# Altium schematic sheet Mux_Demux.SchDoc
size OrCAD E; SheetNumber: 3; SheetTotal: 6
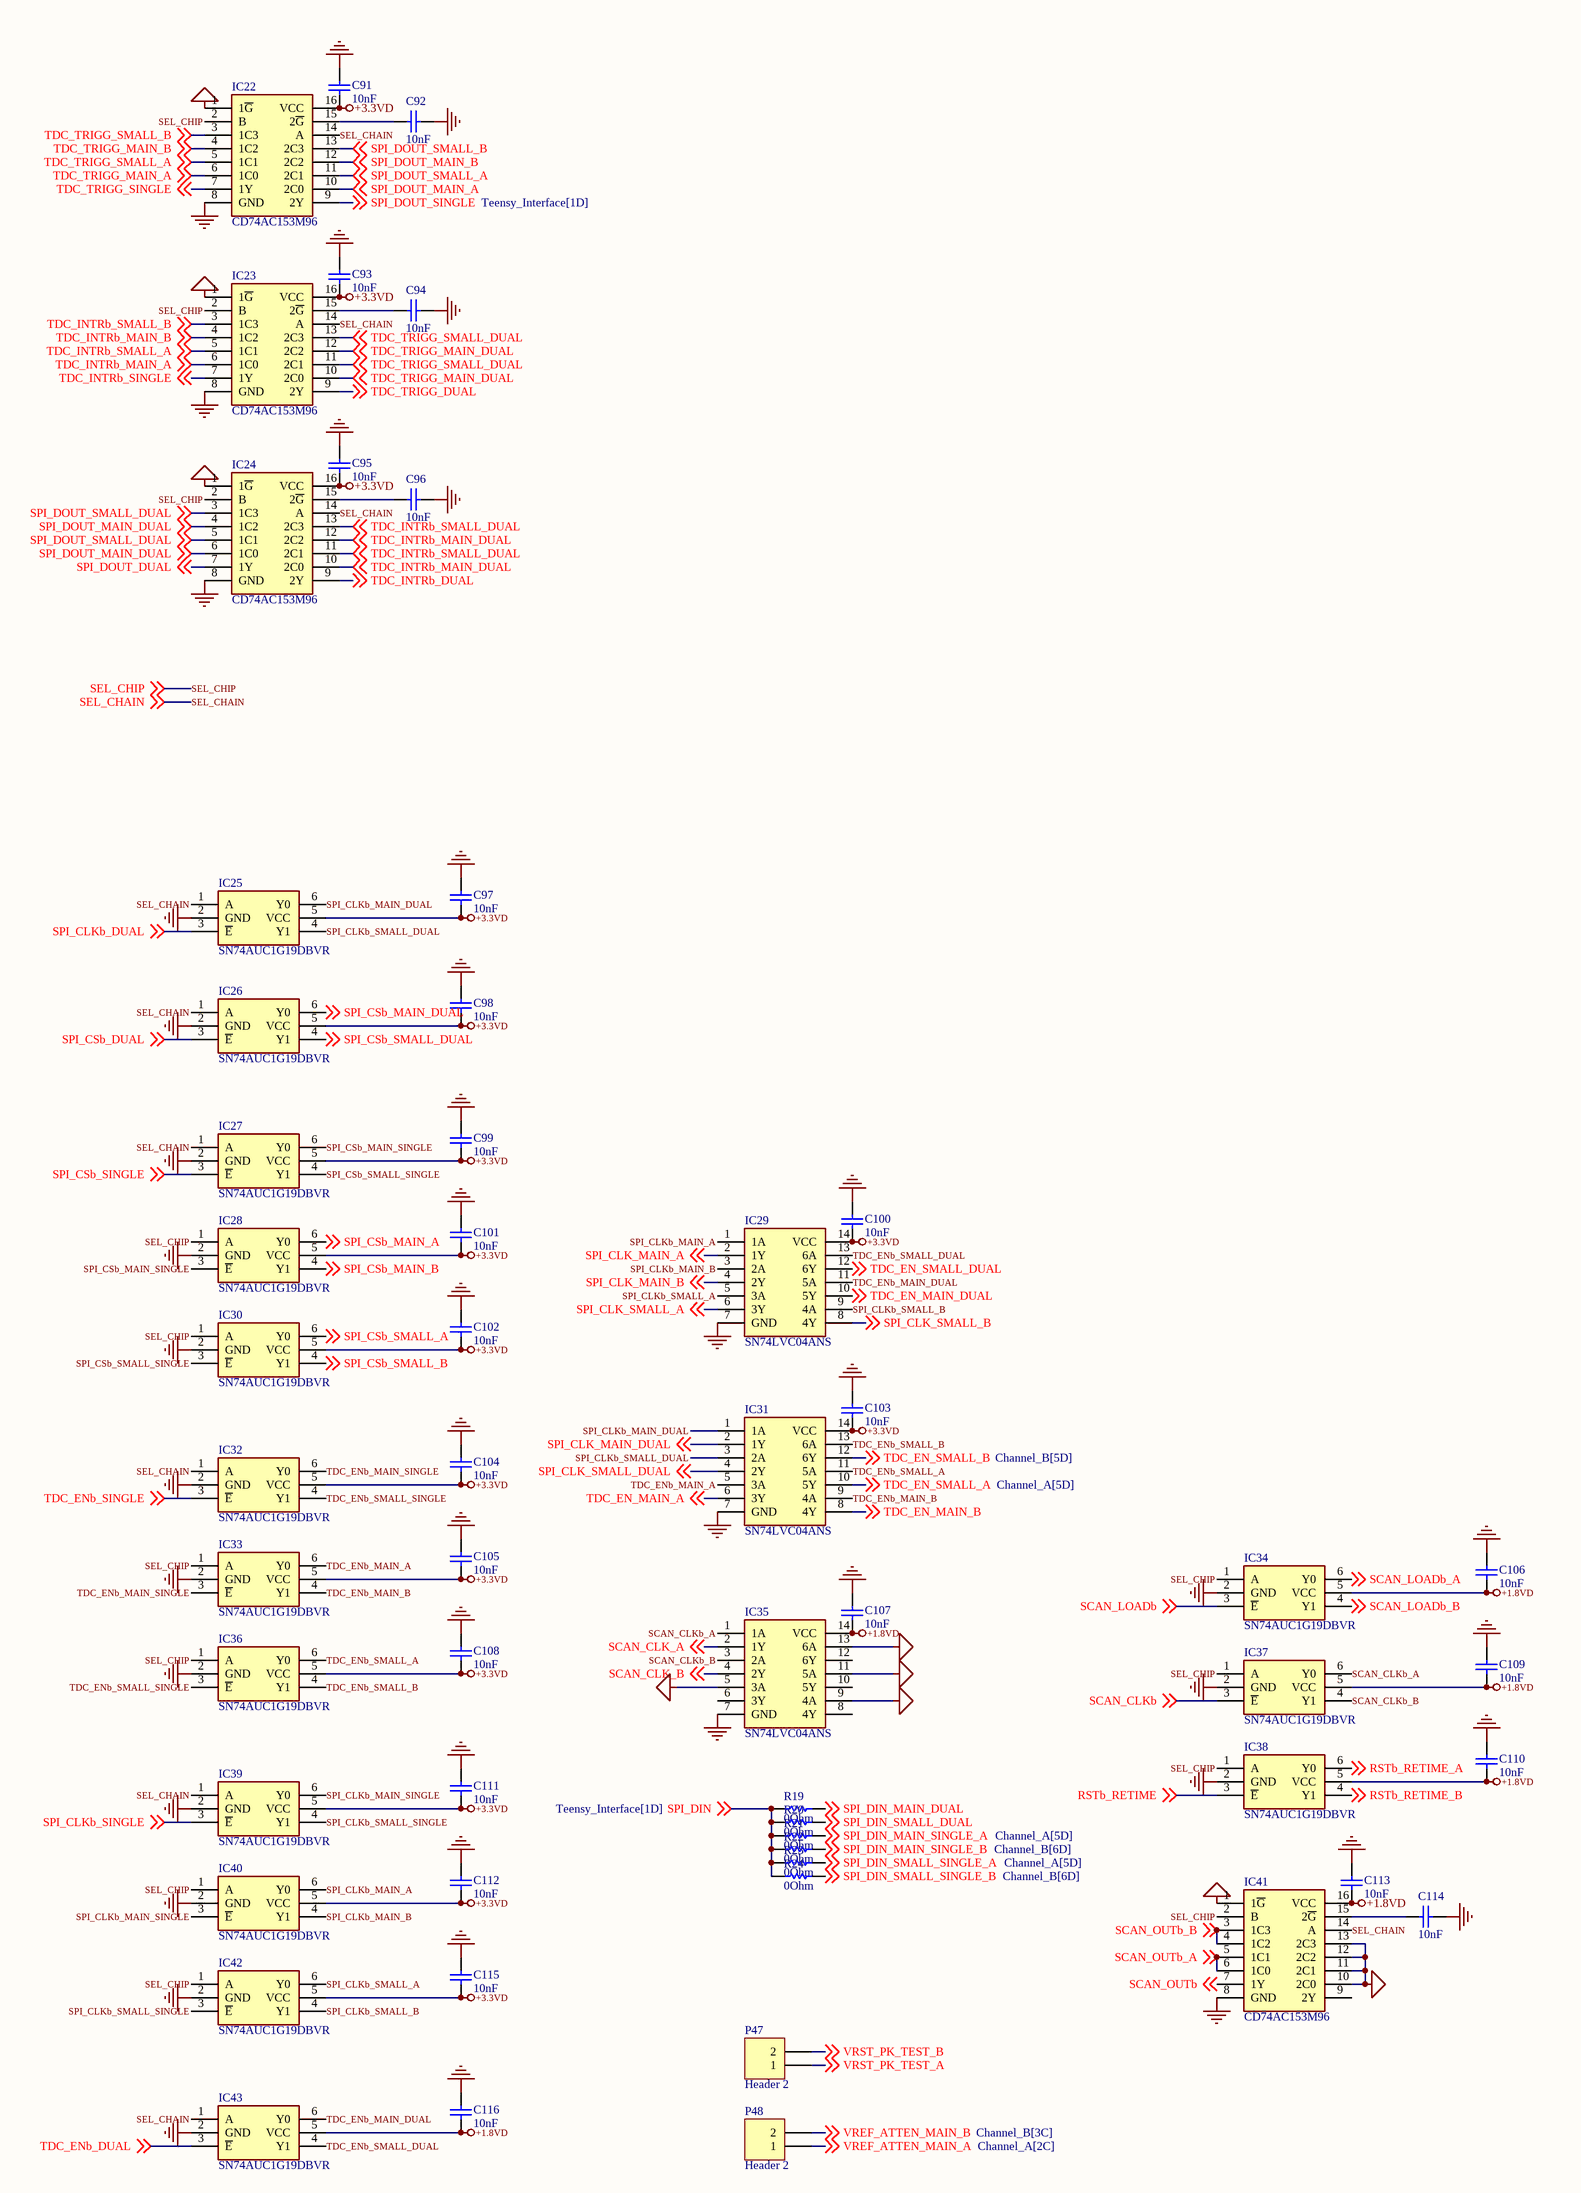
[diagram p0: Mux_Demux.SchDoc]

## Parts
C91  10nF  [CAPC1608X90X35ML10T15]
C92  10nF  [CAPC1608X90X35ML10T15]
C93  10nF  [CAPC1608X90X35ML10T15]
C94  10nF  [CAPC1608X90X35ML10T15]
C95  10nF  [CAPC1608X90X35ML10T15]
C96  10nF  [CAPC1608X90X35ML10T15]
C97  10nF  [CAPC1608X90X35ML10T15]
C98  10nF  [CAPC1608X90X35ML10T15]
C99  10nF  [CAPC1608X90X35ML10T15]
C100  10nF  [CAPC1608X90X35ML10T15]
C101  10nF  [CAPC1608X90X35ML10T15]
C102  10nF  [CAPC1608X90X35ML10T15]
C103  10nF  [CAPC1608X90X35ML10T15]
C104  10nF  [CAPC1608X90X35ML10T15]
C105  10nF  [CAPC1608X90X35ML10T15]
C106  10nF  [CAPC1608X90X35ML10T15]
C107  10nF  [CAPC1608X90X35ML10T15]
C108  10nF  [CAPC1608X90X35ML10T15]
C109  10nF  [CAPC1608X90X35ML10T15]
C110  10nF  [CAPC1608X90X35ML10T15]
C111  10nF  [CAPC1608X90X35ML10T15]
C112  10nF  [CAPC1608X90X35ML10T15]
C113  10nF  [CAPC1608X90X35ML10T15]
C114  10nF  [CAPC1608X90X35ML10T15]
C115  10nF  [CAPC1608X90X35ML10T15]
C116  10nF  [CAPC1608X90X35ML10T15]
IC22  CD74AC153M96  [SOIC127P600X175-16N]
IC23  CD74AC153M96  [SOIC127P600X175-16N]
IC24  CD74AC153M96  [SOIC127P600X175-16N]
IC25  SN74AUC1G19DBVR  [SOT95P280X145-6N]
IC26  SN74AUC1G19DBVR  [SOT95P280X145-6N]
IC27  SN74AUC1G19DBVR  [SOT95P280X145-6N]
IC28  SN74AUC1G19DBVR  [SOT95P280X145-6N]
IC29  SN74LVC04ANS  [SOIC127P780X200-14N]
IC30  SN74AUC1G19DBVR  [SOT95P280X145-6N]
IC31  SN74LVC04ANS  [SOIC127P780X200-14N]
IC32  SN74AUC1G19DBVR  [SOT95P280X145-6N]
IC33  SN74AUC1G19DBVR  [SOT95P280X145-6N]
IC34  SN74AUC1G19DBVR  [SOT95P280X145-6N]
IC35  SN74LVC04ANS  [SOIC127P780X200-14N]
IC36  SN74AUC1G19DBVR  [SOT95P280X145-6N]
IC37  SN74AUC1G19DBVR  [SOT95P280X145-6N]
IC38  SN74AUC1G19DBVR  [SOT95P280X145-6N]
IC39  SN74AUC1G19DBVR  [SOT95P280X145-6N]
IC40  SN74AUC1G19DBVR  [SOT95P280X145-6N]
IC41  CD74AC153M96  [SOIC127P600X175-16N]
IC42  SN74AUC1G19DBVR  [SOT95P280X145-6N]
IC43  SN74AUC1G19DBVR  [SOT95P280X145-6N]
P47  Header 2  [HDR1X2]
P48  Header 2  [HDR1X2]
R19  0Ohm  [RESC1609X50X30NL8T20]
R20  0Ohm  [RESC1609X50X30NL8T20]
R21  0Ohm  [RESC1609X50X30NL8T20]
R22  0Ohm  [RESC1609X50X30NL8T20]
R23  0Ohm  [RESC1609X50X30NL8T20]
R24  0Ohm  [RESC1609X50X30NL8T20]

## Nets
+1.8VD: C106.1 C107.1 C109.1 C110.1 C113.1 C116.1 IC34.5(VCC) IC35.14(VCC) IC37.5(VCC) IC38.5(VCC) IC41.16(VCC) IC43.5(VCC)
+3.3VD: C91.1 C93.1 C95.1 C97.1 C98.1 C99.1 C100.1 C101.1 C102.1 C103.1 C104.1 C105.1 C108.1 C111.1 C112.1 C115.1 IC22.16(VCC) IC23.16(VCC) IC24.16(VCC) IC25.5(VCC) IC26.5(VCC) IC27.5(VCC) IC28.5(VCC) IC29.14(VCC) IC30.5(VCC) IC31.14(VCC) IC32.5(VCC) IC33.5(VCC) IC36.5(VCC) IC39.5(VCC) IC40.5(VCC) IC42.5(VCC)
GND: C91.2 C92.2 C93.2 C94.2 C95.2 C96.2 C97.2 C98.2 C99.2 C100.2 C101.2 C102.2 C103.2 C104.2 C105.2 C106.2 C107.2 C108.2 C109.2 C110.2 C111.2 C112.2 C113.2 C114.2 C115.2 C116.2 IC22.1(1~{G}) IC22.8(GND) IC23.1(1~{G}) IC23.8(GND) IC24.1(1~{G}) IC24.8(GND) IC25.2(GND) IC26.2(GND) IC27.2(GND) IC28.2(GND) IC29.7(GND) IC30.2(GND) IC31.7(GND) IC32.2(GND) IC33.2(GND) IC34.2(GND) IC35.5(3A) IC35.7(GND) IC35.9(4A) IC35.11(5A) IC35.13(6A) IC36.2(GND) IC37.2(GND) IC38.2(GND) IC39.2(GND) IC40.2(GND) IC41.1(1~{G}) IC41.8(GND) IC41.10(2C0) IC41.11(2C1) IC41.12(2C2) IC41.13(2C3) IC42.2(GND) IC43.2(GND)
RSTb_RETIME: IC38.3(~{E}) ; off-sheet RSTb_RETIME
RSTb_RETIME_A: IC38.6(Y0) ; off-sheet RSTb_RETIME_A
RSTb_RETIME_B: IC38.4(Y1) ; off-sheet RSTb_RETIME_B
SCAN_CLK_A: IC35.2(1Y) ; off-sheet SCAN_CLK_A
SCAN_CLK_B: IC35.4(2Y) ; off-sheet SCAN_CLK_B
SCAN_CLKb: IC37.3(~{E}) ; off-sheet SCAN_CLKb
SCAN_CLKb_A: IC35.1(1A) IC37.6(Y0)
SCAN_CLKb_B: IC35.3(2A) IC37.4(Y1)
SCAN_LOADb: IC34.3(~{E}) ; off-sheet SCAN_LOADb
SCAN_LOADb_A: IC34.6(Y0) ; off-sheet SCAN_LOADb_A
SCAN_LOADb_B: IC34.4(Y1) ; off-sheet SCAN_LOADb_B
SCAN_OUTb: IC41.7(1Y) ; off-sheet SCAN_OUTb
SCAN_OUTb_A: IC41.5(1C1) IC41.6(1C0) ; off-sheet SCAN_OUTb_A
SCAN_OUTb_B: IC41.3(1C3) IC41.4(1C2) ; off-sheet SCAN_OUTb_B
SEL_CHAIN: IC22.14(A) IC23.14(A) IC24.14(A) IC25.1(A) IC26.1(A) IC27.1(A) IC32.1(A) IC39.1(A) IC41.14(A) IC43.1(A) ; off-sheet SEL_CHAIN
SEL_CHIP: IC22.2(B) IC23.2(B) IC24.2(B) IC28.1(A) IC30.1(A) IC33.1(A) IC34.1(A) IC36.1(A) IC37.1(A) IC38.1(A) IC40.1(A) IC41.2(B) IC42.1(A) ; off-sheet SEL_CHIP
SPI_CLK_MAIN_A: IC29.2(1Y) ; off-sheet SPI_CLK_MAIN_A
SPI_CLK_MAIN_B: IC29.4(2Y) ; off-sheet SPI_CLK_MAIN_B
SPI_CLK_MAIN_DUAL: IC31.2(1Y) ; off-sheet SPI_CLK_MAIN_DUAL
SPI_CLK_SMALL_A: IC29.6(3Y) ; off-sheet SPI_CLK_SMALL_A
SPI_CLK_SMALL_B: IC29.8(4Y) ; off-sheet SPI_CLK_SMALL_B
SPI_CLK_SMALL_DUAL: IC31.4(2Y) ; off-sheet SPI_CLK_SMALL_DUAL
SPI_CLKb_DUAL: IC25.3(~{E}) ; off-sheet SPI_CLKb_DUAL
SPI_CLKb_MAIN_A: IC29.1(1A) IC40.6(Y0)
SPI_CLKb_MAIN_B: IC29.3(2A) IC40.4(Y1)
SPI_CLKb_MAIN_DUAL: IC25.6(Y0) IC31.1(1A)
SPI_CLKb_MAIN_SINGLE: IC39.6(Y0) IC40.3(~{E})
SPI_CLKb_SINGLE: IC39.3(~{E}) ; off-sheet SPI_CLKb_SINGLE
SPI_CLKb_SMALL_A: IC29.5(3A) IC42.6(Y0)
SPI_CLKb_SMALL_B: IC29.9(4A) IC42.4(Y1)
SPI_CLKb_SMALL_DUAL: IC25.4(Y1) IC31.3(2A)
SPI_CLKb_SMALL_SINGLE: IC39.4(Y1) IC42.3(~{E})
SPI_CSb_DUAL: IC26.3(~{E}) ; off-sheet SPI_CSb_DUAL
SPI_CSb_MAIN_A: IC28.6(Y0) ; off-sheet SPI_CSb_MAIN_A
SPI_CSb_MAIN_B: IC28.4(Y1) ; off-sheet SPI_CSb_MAIN_B
SPI_CSb_MAIN_DUAL: IC26.6(Y0) ; off-sheet SPI_CSb_MAIN_DUAL
SPI_CSb_MAIN_SINGLE: IC27.6(Y0) IC28.3(~{E})
SPI_CSb_SINGLE: IC27.3(~{E}) ; off-sheet SPI_CSb_SINGLE
SPI_CSb_SMALL_A: IC30.6(Y0) ; off-sheet SPI_CSb_SMALL_A
SPI_CSb_SMALL_B: IC30.4(Y1) ; off-sheet SPI_CSb_SMALL_B
SPI_CSb_SMALL_DUAL: IC26.4(Y1) ; off-sheet SPI_CSb_SMALL_DUAL
SPI_CSb_SMALL_SINGLE: IC27.4(Y1) IC30.3(~{E})
SPI_DIN: R19.2 R20.2 R21.2 R22.2 R23.2 R24.2 ; off-sheet SPI_DIN
SPI_DIN_MAIN_DUAL: R19.1 ; off-sheet SPI_DIN_MAIN_DUAL
SPI_DIN_MAIN_SINGLE_A: R21.1 ; off-sheet SPI_DIN_MAIN_SINGLE_A
SPI_DIN_MAIN_SINGLE_B: R22.1 ; off-sheet SPI_DIN_MAIN_SINGLE_B
SPI_DIN_SMALL_DUAL: R20.1 ; off-sheet SPI_DIN_SMALL_DUAL
SPI_DIN_SMALL_SINGLE_A: R23.1 ; off-sheet SPI_DIN_SMALL_SINGLE_A
SPI_DIN_SMALL_SINGLE_B: R24.1 ; off-sheet SPI_DIN_SMALL_SINGLE_B
SPI_DOUT_DUAL: IC24.7(1Y) ; off-sheet SPI_DOUT_DUAL
SPI_DOUT_MAIN_A: IC22.10(2C0) ; off-sheet SPI_DOUT_MAIN_A
SPI_DOUT_MAIN_B: IC22.12(2C2) ; off-sheet SPI_DOUT_MAIN_B
SPI_DOUT_MAIN_DUAL: IC24.4(1C2) IC24.6(1C0) ; off-sheet SPI_DOUT_MAIN_DUAL
SPI_DOUT_SINGLE: IC22.9(2Y) ; off-sheet SPI_DOUT_SINGLE
SPI_DOUT_SMALL_A: IC22.11(2C1) ; off-sheet SPI_DOUT_SMALL_A
SPI_DOUT_SMALL_B: IC22.13(2C3) ; off-sheet SPI_DOUT_SMALL_B
SPI_DOUT_SMALL_DUAL: IC24.3(1C3) IC24.5(1C1) ; off-sheet SPI_DOUT_SMALL_DUAL
TDC_EN_MAIN_A: IC31.6(3Y) ; off-sheet TDC_EN_MAIN_A
TDC_EN_MAIN_B: IC31.8(4Y) ; off-sheet TDC_EN_MAIN_B
TDC_EN_MAIN_DUAL: IC29.10(5Y) ; off-sheet TDC_EN_MAIN_DUAL
TDC_EN_SMALL_A: IC31.10(5Y) ; off-sheet TDC_EN_SMALL_A
TDC_EN_SMALL_B: IC31.12(6Y) ; off-sheet TDC_EN_SMALL_B
TDC_EN_SMALL_DUAL: IC29.12(6Y) ; off-sheet TDC_EN_SMALL_DUAL
TDC_ENb_DUAL: IC43.3(~{E}) ; off-sheet TDC_ENb_DUAL
TDC_ENb_MAIN_A: IC31.5(3A) IC33.6(Y0)
TDC_ENb_MAIN_B: IC31.9(4A) IC33.4(Y1)
TDC_ENb_MAIN_DUAL: IC29.11(5A) IC43.6(Y0)
TDC_ENb_MAIN_SINGLE: IC32.6(Y0) IC33.3(~{E})
TDC_ENb_SINGLE: IC32.3(~{E}) ; off-sheet TDC_ENb_SINGLE
TDC_ENb_SMALL_A: IC31.11(5A) IC36.6(Y0)
TDC_ENb_SMALL_B: IC31.13(6A) IC36.4(Y1)
TDC_ENb_SMALL_DUAL: IC29.13(6A) IC43.4(Y1)
TDC_ENb_SMALL_SINGLE: IC32.4(Y1) IC36.3(~{E})
TDC_INTRb_DUAL: IC24.9(2Y) ; off-sheet TDC_INTRb_DUAL
TDC_INTRb_MAIN_A: IC23.6(1C0) ; off-sheet TDC_INTRb_MAIN_A
TDC_INTRb_MAIN_B: IC23.4(1C2) ; off-sheet TDC_INTRb_MAIN_B
TDC_INTRb_MAIN_DUAL: IC24.10(2C0) IC24.12(2C2) ; off-sheet TDC_INTRb_MAIN_DUAL
TDC_INTRb_SINGLE: IC23.7(1Y) ; off-sheet TDC_INTRb_SINGLE
TDC_INTRb_SMALL_A: IC23.5(1C1) ; off-sheet TDC_INTRb_SMALL_A
TDC_INTRb_SMALL_B: IC23.3(1C3) ; off-sheet TDC_INTRb_SMALL_B
TDC_INTRb_SMALL_DUAL: IC24.11(2C1) IC24.13(2C3) ; off-sheet TDC_INTRb_SMALL_DUAL
TDC_TRIGG_DUAL: IC23.9(2Y) ; off-sheet TDC_TRIGG_DUAL
TDC_TRIGG_MAIN_A: IC22.6(1C0) ; off-sheet TDC_TRIGG_MAIN_A
TDC_TRIGG_MAIN_B: IC22.4(1C2) ; off-sheet TDC_TRIGG_MAIN_B
TDC_TRIGG_MAIN_DUAL: IC23.10(2C0) IC23.12(2C2) ; off-sheet TDC_TRIGG_MAIN_DUAL
TDC_TRIGG_SINGLE: IC22.7(1Y) ; off-sheet TDC_TRIGG_SINGLE
TDC_TRIGG_SMALL_A: IC22.5(1C1) ; off-sheet TDC_TRIGG_SMALL_A
TDC_TRIGG_SMALL_B: IC22.3(1C3) ; off-sheet TDC_TRIGG_SMALL_B
TDC_TRIGG_SMALL_DUAL: IC23.11(2C1) IC23.13(2C3) ; off-sheet TDC_TRIGG_SMALL_DUAL
VREF_ATTEN_MAIN_A: P48.1 ; off-sheet VREF_ATTEN_MAIN_A
VREF_ATTEN_MAIN_B: P48.2 ; off-sheet VREF_ATTEN_MAIN_B
VRST_PK_TEST_A: P47.1 ; off-sheet VRST_PK_TEST_A
VRST_PK_TEST_B: P47.2 ; off-sheet VRST_PK_TEST_B
NetC92_1: C92.1 IC22.15(2~{G})
NetC94_1: C94.1 IC23.15(2~{G})
NetC96_1: C96.1 IC24.15(2~{G})
NetC114_1: C114.1 IC41.15(2~{G})

Not connected (* = marked no-connect by the designer): IC35 6(3Y) 8(4Y) 10(5Y) 12(6Y); IC41 9(2Y)

## Library data of the parts
C91-C116 = CMP-2000-04945-1: 0603; Manufacturer: Murata; Capacitance: 22pF; Tolerance (%): ±5%; Rated Voltage: 50V; Dielectric: C0G; Manufacturer URL: http://www.murata.com/; Datasheet Version: Jul-06; Package Reference: 603; Case Size/Dimension: 0603; Package Description: 2-Pin Surface Mount Device, Body 1.6 x 0.8 mm; Datasheet URL: https://datasheet.ciiva.com/11786/0900766b807a1cab-11786398.pdf
IC22-IC24 IC41 = CD74AC153M96: Encoders, Decoders, Multiplexers & Demultiplexers Dual 4-Input; Manufacturer_Name: Texas Instruments; Datasheet Link: https://www.ti.com/lit/ds/symlink/cd74ac153.pdf?ts=1617785711495&ref_url=https%253A%252F%252Fwww.ti.com%252Fstore%252Fti%252Fen%252Fp%252Fproduct%252F%253Fp%253DCD74AC153M96; Height: 1.75mm; Manufacturer_Part_Number: CD74AC153M96; Mouser Part Number: 595-CD74AC153M96; Mouser Price/Stock: https://www.mouser.co.uk/ProductDetail/Texas-Instruments/CD74AC153M96?qs=bkMXpVdiF41Yiv9m4vuwDg%3D%3D; Arrow Part Number: CD74AC153M96; Arrow Price/Stock: https://www.arrow.com/en/products/cd74ac153m96/texas-instruments
IC25-IC28 IC30 IC32-IC34 IC36-IC40 IC42 IC43 = SN74AUC1G19DBVR: Encoders, Decoders, Multiplexers & Demultiplexers 1 of 2 Decoder DeMultxe; Manufacturer_Name: Texas Instruments; Datasheet Link: http://www.ti.com/lit/gpn/sn74auc1g19; Height: 1.45mm; Manufacturer_Part_Number: SN74AUC1G19DBVR; Mouser Part Number: 595-SN74AUC1G19DBVR; Mouser Price/Stock: https://www.mouser.com/Search/Refine.aspx?Keyword=595-SN74AUC1G19DBVR
IC29 IC31 IC35 = SN74LVC04ANS: Inverters Hex Inverter; Manufacturer_Name: Texas Instruments; Datasheet Link: http://www.ti.com/lit/ds/symlink/sn74lvc04a.pdf; Height: 2mm; Manufacturer_Part_Number: SN74LVC04ANS; Mouser Part Number: 595-SN74LVC04ANS; Mouser Price/Stock: https://www.mouser.co.uk/ProductDetail/Texas-Instruments/SN74LVC04ANS?qs=4%2FQr8XCwynNuUCMn78xqww%3D%3D
P47 P48 = Header 2: Header, 2-Pin; LatestRevisionDate: 17-Jul-2002; LatestRevisionNote: Re-released for DXP Platform.; Publisher: Altium Limited
R19-R24 = CMP-2000-03816-5: 0603; Manufacturer: Vishay Semiconductor; Voltage Rating: 75 V; Package Quantity: 5000; DatasheetVersion: 06/2012; Min Operating Temperature: -55 degC; ComponentLink1URL: http://www.vishay.com/; Mounting Technology: Surface Mount; Height: 0.45 mm; ComponentLink1Description: Manufacturer URL; REACH SVHC: Unknown; PackageReference: 0603; Packaging: Tape and Reel; Max Operating Temperature: 155 degC; Mount: Surface Mount; ComponentLink2Description: Datasheet; PackageDescription: 2-Pin Surface Mount Device, Body 1.575 x 0.85 mm; Length: 1.55 mm; ComponentLink2URL: http://www.vishay.com/docs/20035/dcrcwe3.pdf; Pins: 2; RoHSCompliant: true